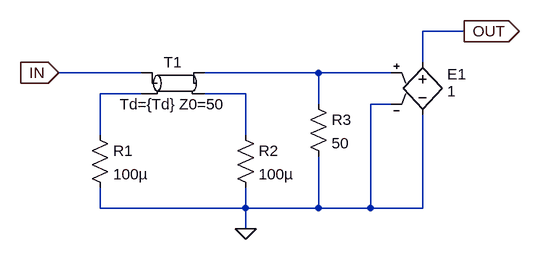
[diagram p0: schematic Zminus1.asc]
Zminus1.asc, the LTspice schematic file:
Version 4
SHEET 1 880 680
WIRE 624 80 560 80
WIRE 560 128 560 80
WIRE 128 144 0 144
WIRE 400 144 224 144
WIRE 512 144 400 144
WIRE 128 176 64 176
WIRE 288 176 224 176
WIRE 400 192 400 144
WIRE 512 192 480 192
WIRE 64 240 64 176
WIRE 288 240 288 176
WIRE 64 352 64 320
WIRE 288 352 288 320
WIRE 288 352 64 352
WIRE 400 352 400 272
WIRE 400 352 288 352
WIRE 480 352 480 192
WIRE 480 352 400 352
WIRE 560 352 560 208
WIRE 560 352 480 352
WIRE 288 384 288 352
FLAG 624 80 OUT
IOPIN 624 80 Out
FLAG 0 144 IN
IOPIN 0 144 In
FLAG 288 384 0
SYMBOL tline 176 160 R0
SYMATTR InstName T1
SYMATTR Value Td={Td} Z0=50
SYMBOL res 48 224 R0
SYMATTR InstName R1
SYMATTR Value 100µ
SYMBOL res 272 224 R0
SYMATTR InstName R2
SYMATTR Value 100µ
SYMBOL res 384 176 R0
SYMATTR InstName R3
SYMATTR Value 50
SYMBOL e 560 112 R0
WINDOW 0 38 34 Left 2
WINDOW 3 38 60 Left 2
SYMATTR InstName E1
SYMATTR Value 1

The netlist it stands for:
* Zminus1.asc
T1 IN N002 N001 N003 Td={Td} Z0=50
R1 N002 0 100µ
R2 N003 0 100µ
R3 N001 0 50
E1 OUT 0 N001 0 1
.backanno
.end